# Altium schematic sheet FPGA_UNUSED.SchDoc
size 393 x 281 mm; PageSetup: Record=PageOptions|CenterHorizontal=True|CenterVertical=True|PrintScale=0.94|XCorrection=0.00|YCorrection=0.00|PrintKind=0|BorderSize=5000000|LeftOffset=0|BottomOffset=0|Orientation=2|PaperLength=1000|PaperWidth=1000|Scale=100|PaperSource=15|PrintQuality=600|MediaType=1|DitherType=10|PrintScaleMode=1|PaperKind=A4; Adr1: August Barks gata 6B; Adr2: SE-421 32 Västra Frölunda; Adr3: Sweden; Webpage: www.omnisys.se
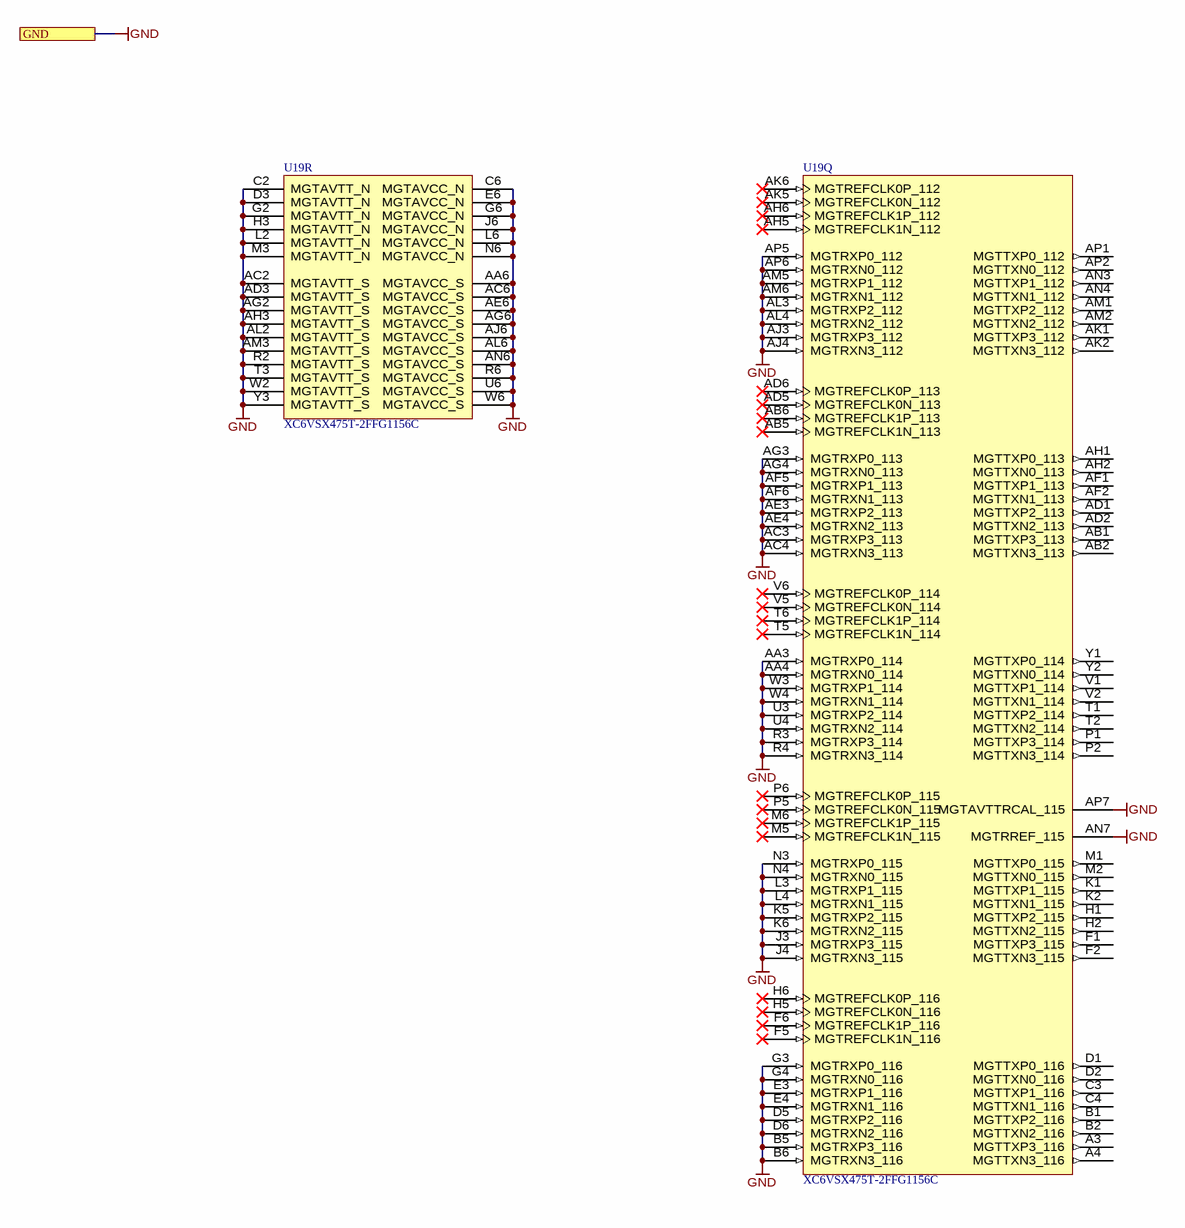
[diagram p0: FPGA_UNUSED.SchDoc]

## Parts
U19  XC6VSX475T-2FFG1156C  [FFG1156]  (parts Q,R of 20)

## Ports
GND

## Nets
GND: U19.AA3(MGTRXP0_114) U19.AA4(MGTRXN0_114) U19.AA6(MGTAVCC_S) U19.AC2(MGTAVTT_S) U19.AC3(MGTRXP3_113) U19.AC4(MGTRXN3_113) U19.AC6(MGTAVCC_S) U19.AD3(MGTAVTT_S) U19.AE3(MGTRXP2_113) U19.AE4(MGTRXN2_113) U19.AE6(MGTAVCC_S) U19.AF5(MGTRXP1_113) U19.AF6(MGTRXN1_113) U19.AG2(MGTAVTT_S) U19.AG3(MGTRXP0_113) U19.AG4(MGTRXN0_113) U19.AG6(MGTAVCC_S) U19.AH3(MGTAVTT_S) U19.AJ3(MGTRXP3_112) U19.AJ4(MGTRXN3_112) U19.AJ6(MGTAVCC_S) U19.AL2(MGTAVTT_S) U19.AL3(MGTRXP2_112) U19.AL4(MGTRXN2_112) U19.AL6(MGTAVCC_S) U19.AM3(MGTAVTT_S) U19.AM5(MGTRXP1_112) U19.AM6(MGTRXN1_112) U19.AN6(MGTAVCC_S) U19.AN7(MGTRREF_115) U19.AP5(MGTRXP0_112) U19.AP6(MGTRXN0_112) U19.AP7(MGTAVTTRCAL_115) U19.B5(MGTRXP3_116) U19.B6(MGTRXN3_116) U19.C2(MGTAVTT_N) U19.C6(MGTAVCC_N) U19.D3(MGTAVTT_N) U19.D5(MGTRXP2_116) U19.D6(MGTRXN2_116) U19.E3(MGTRXP1_116) U19.E4(MGTRXN1_116) U19.E6(MGTAVCC_N) U19.G2(MGTAVTT_N) U19.G3(MGTRXP0_116) U19.G4(MGTRXN0_116) U19.G6(MGTAVCC_N) U19.H3(MGTAVTT_N) U19.J3(MGTRXP3_115) U19.J4(MGTRXN3_115) U19.J6(MGTAVCC_N) U19.K5(MGTRXP2_115) U19.K6(MGTRXN2_115) U19.L2(MGTAVTT_N) U19.L3(MGTRXP1_115) U19.L4(MGTRXN1_115) U19.L6(MGTAVCC_N) U19.M3(MGTAVTT_N) U19.N3(MGTRXP0_115) U19.N4(MGTRXN0_115) U19.N6(MGTAVCC_N) U19.R2(MGTAVTT_S) U19.R3(MGTRXP3_114) U19.R4(MGTRXN3_114) U19.R6(MGTAVCC_S) U19.T3(MGTAVTT_S) U19.U3(MGTRXP2_114) U19.U4(MGTRXN2_114) U19.U6(MGTAVCC_S) U19.W2(MGTAVTT_S) U19.W3(MGTRXP1_114) U19.W4(MGTRXN1_114) U19.W6(MGTAVCC_S) U19.Y3(MGTAVTT_S) ; port GND

Not connected (* = marked no-connect by the designer): U19 A3(MGTTXP3_116) A4(MGTTXN3_116) AB1(MGTTXP3_113) AB2(MGTTXN3_113) AB5(MGTREFCLK1N_113)* AB6(MGTREFCLK1P_113)* AD1(MGTTXP2_113) AD2(MGTTXN2_113) AD5(MGTREFCLK0N_113)* AD6(MGTREFCLK0P_113)* AF1(MGTTXP1_113) AF2(MGTTXN1_113) AH1(MGTTXP0_113) AH2(MGTTXN0_113) AH5(MGTREFCLK1N_112)* AH6(MGTREFCLK1P_112)* AK1(MGTTXP3_112) AK2(MGTTXN3_112) AK5(MGTREFCLK0N_112)* AK6(MGTREFCLK0P_112)* AM1(MGTTXP2_112) AM2(MGTTXN2_112) AN3(MGTTXP1_112) AN4(MGTTXN1_112) AP1(MGTTXP0_112) AP2(MGTTXN0_112) B1(MGTTXP2_116) B2(MGTTXN2_116) C3(MGTTXP1_116) C4(MGTTXN1_116) D1(MGTTXP0_116) D2(MGTTXN0_116) F1(MGTTXP3_115) F2(MGTTXN3_115) F5(MGTREFCLK1N_116)* F6(MGTREFCLK1P_116)* H1(MGTTXP2_115) H2(MGTTXN2_115) H5(MGTREFCLK0N_116)* H6(MGTREFCLK0P_116)* K1(MGTTXP1_115) K2(MGTTXN1_115) M1(MGTTXP0_115) M2(MGTTXN0_115) M5(MGTREFCLK1N_115)* M6(MGTREFCLK1P_115)* P1(MGTTXP3_114) P2(MGTTXN3_114) P5(MGTREFCLK0N_115)* P6(MGTREFCLK0P_115)* T1(MGTTXP2_114) T2(MGTTXN2_114) T5(MGTREFCLK1N_114)* T6(MGTREFCLK1P_114)* V1(MGTTXP1_114) V2(MGTTXN1_114) V5(MGTREFCLK0N_114)* V6(MGTREFCLK0P_114)* Y1(MGTTXP0_114) Y2(MGTTXN0_114)

## Notes on the sheet
- Title:
- SVN:
- August Barks gata 6B
- SE-421 32 Västra Frölunda
- Omnisys Instruments AB
- PCB ASY:
- PCB:
- SVN Folder:
- www.omnisys.se
- Page:
- of
- Print date:
- Page size:
- A3
- Information contained in this drawing is confidential. Copying, distributing or use in any matter, other than that specified by OMNISYS INSTRUMENTS AB, is strictly prohibited.

## Library data of the parts
U19 = CMP-0083-00172-1: Virtex-6 SXT Platform FPGA, 600 User I/Os, 20 GTXs, 1156-Ball FFBGA, Speed Grade 2, Commercial Grade, Pb-Free; Code_JEDEC: MS-034-AAR-1; PackageReference: FFG1156; Code_IPC: BGA100P34X34-1156; PackageDescription: 1156-Ball Flip-Chip Fine Pitch Ball Grid Array (FFG1156) - Pb-Free; PackageVersion: ver1.0, Jan-2010; DatasheetVersion: ver2.2, Jan-2010; PartId: 1